# Altium schematic sheet Display Driver.SchDoc
size B
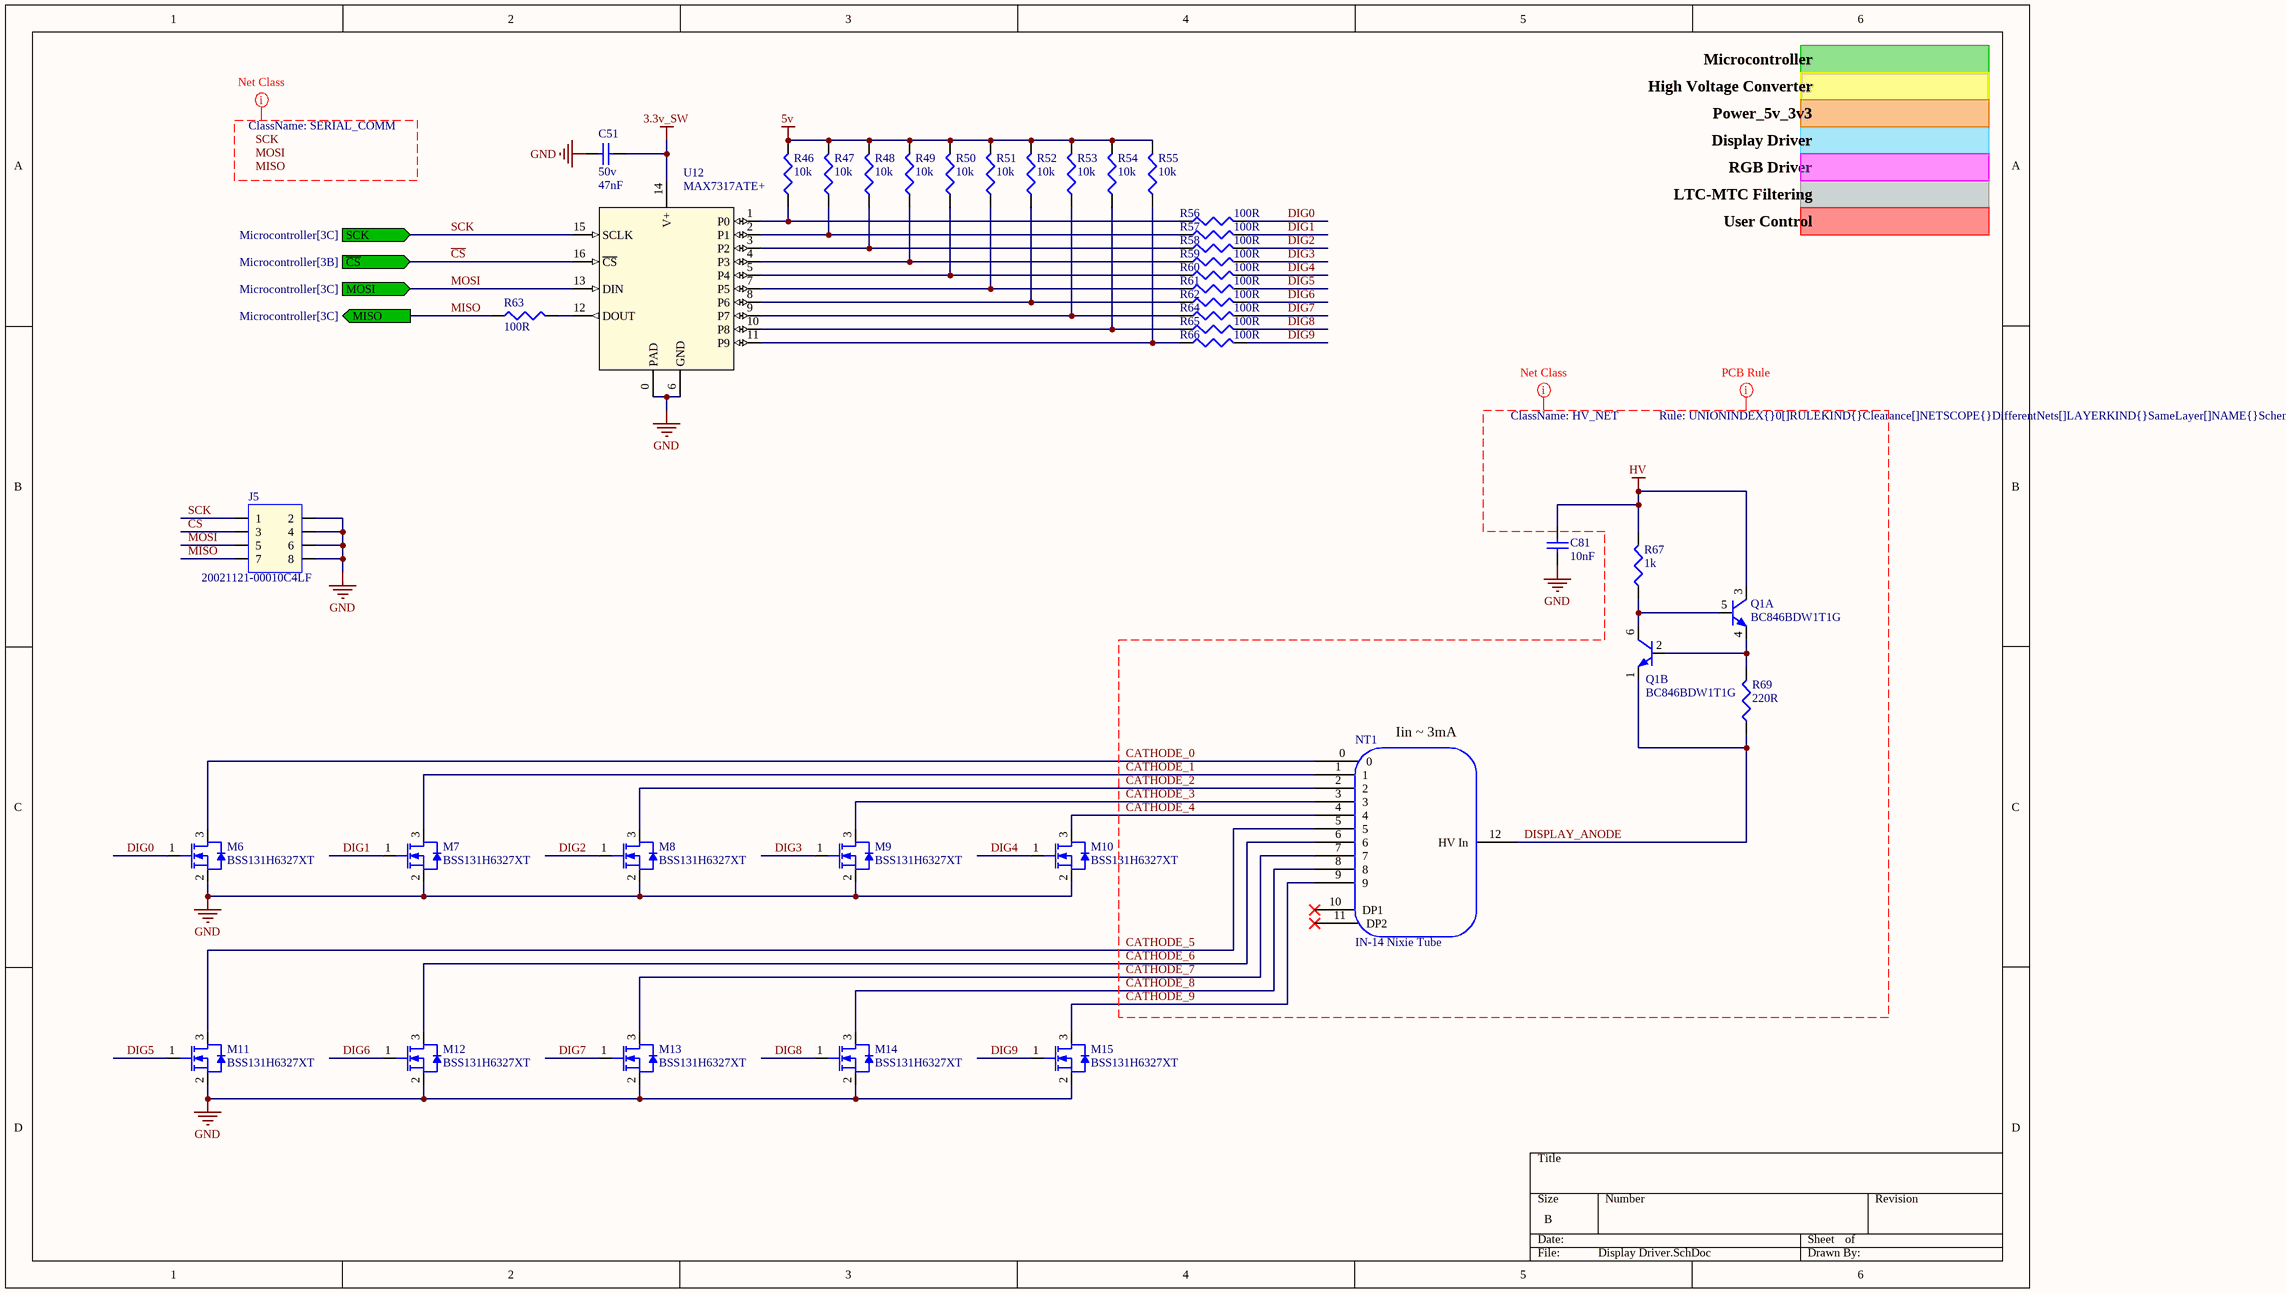
[diagram p0: Display Driver.SchDoc]

## Parts
C51  Voltage: 50v  [CAP0603R]  (hidden comment: 47nF)
C81  10nF  [CAP0805R]
J5  20021121-00010C4LF  [2x4 SMD Header 1.27mm]
M6  BSS131H6327XT  [SOT23-3 REFLOW]
M7  BSS131H6327XT  [SOT23-3 REFLOW]
M8  BSS131H6327XT  [SOT23-3 REFLOW]
M9  BSS131H6327XT  [SOT23-3 REFLOW]
M10  BSS131H6327XT  [SOT23-3 REFLOW]
M11  BSS131H6327XT  [SOT23-3 REFLOW]
M12  BSS131H6327XT  [SOT23-3 REFLOW]
M13  BSS131H6327XT  [SOT23-3 REFLOW]
M14  BSS131H6327XT  [SOT23-3 REFLOW]
M15  BSS131H6327XT  [SOT23-3 REFLOW]
NT1  IN-14 Nixie Tube  [IN-14 Nixie Tube]
Q1  BC846BDW1T1G  [SC70]  (parts A,B of 2)
R46  10k  [RES0402R]
R47  10k  [RES0402R]
R48  10k  [RES0402R]
R49  10k  [RES0402R]
R50  10k  [RES0402R]
R51  10k  [RES0402R]
R52  10k  [RES0402R]
R53  10k  [RES0402R]
R54  10k  [RES0402R]
R55  10k  [RES0402R]
R56  100R  [RES0402R]
R57  100R  [RES0402R]
R58  100R  [RES0402R]
R59  100R  [RES0402R]
R60  100R  [RES0402R]
R61  100R  [RES0402R]
R62  100R  [RES0402R]
R63  100R  [RES0402R]
R64  100R  [RES0402R]
R65  100R  [RES0402R]
R66  100R  [RES0402R]
R67  1k  [RES0402R]
R69  220R  [RES0603R]
U12  MAX7317ATE+  [TQFN-16]

## Ports
MISO (out, see Microcontroller[3C]), MOSI (in, see Microcontroller[3C]), SCK (in, see Microcontroller[3C]), ~{CS} (in, see Microcontroller[3B])

## Nets
3.3v_SW: C51.2 U12.14(V+)
5v: R46.2 R47.2 R48.2 R49.2 R50.2 R51.2 R52.2 R53.2 R54.2 R55.2
GND: C51.1 C81.2 J5.2 J5.4 J5.6 J5.8 M6.2(SOURCE) M7.2(SOURCE) M8.2(SOURCE) M9.2(SOURCE) M10.2(SOURCE) M11.2(SOURCE) M12.2(SOURCE) M13.2(SOURCE) M14.2(SOURCE) M15.2(SOURCE) U12.0(PAD) U12.6(GND)
HV: C81.1 Q1.3(E1) R67.2
~{CS}: J5.3 U12.16(~{CS}) ; port ~{CS}
CATHODE_0: M6.3(DRAIN) NT1.0
CATHODE_1: M7.3(DRAIN) NT1.1
CATHODE_2: M8.3(DRAIN) NT1.2
CATHODE_3: M9.3(DRAIN) NT1.3
CATHODE_4: M10.3(DRAIN) NT1.4
CATHODE_5: M11.3(DRAIN) NT1.5
CATHODE_6: M12.3(DRAIN) NT1.6
CATHODE_7: M13.3(DRAIN) NT1.7
CATHODE_8: M14.3(DRAIN) NT1.8
CATHODE_9: M15.3(DRAIN) NT1.9
DIG0: M6.1(GATE) R56.2
DIG1: M7.1(GATE) R57.2
DIG2: M8.1(GATE) R58.2
DIG3: M9.1(GATE) R59.2
DIG4: M10.1(GATE) R60.2
DIG5: M11.1(GATE) R61.2
DIG6: M12.1(GATE) R62.2
DIG7: M13.1(GATE) R64.2
DIG8: M14.1(GATE) R65.2
DIG9: M15.1(GATE) R66.2
DISPLAY_ANODE: NT1.12(HV_In) Q1.1(C2) R69.1
MISO: J5.7 R63.1 ; port MISO
MOSI: J5.5 U12.13(DIN) ; port MOSI
SCK: J5.1 U12.15(SCLK) ; port SCK
NetQ1_2: Q1.2(B2) Q1.4(C1) R69.2
NetQ1_5: Q1.5(B1) Q1.6(E2) R67.1
NetR46_1: R46.1 R56.1 U12.1(P0)
NetR47_1: R47.1 R57.1 U12.2(P1)
NetR48_1: R48.1 R58.1 U12.3(P2)
NetR49_1: R49.1 R59.1 U12.4(P3)
NetR50_1: R50.1 R60.1 U12.5(P4)
NetR51_1: R51.1 R61.1 U12.7(P5)
NetR52_1: R52.1 R62.1 U12.8(P6)
NetR53_1: R53.1 R64.1 U12.9(P7)
NetR54_1: R54.1 R65.1 U12.10(P8)
NetR55_1: R55.1 R66.1 U12.11(P9)
NetR63_2: R63.2 U12.12(DOUT)

Not connected (* = marked no-connect by the designer): NT1 10(DP1)* 11(DP2)*

## Layout directives
net class HV_NET: CATHODE_0, CATHODE_1, CATHODE_2, CATHODE_3, CATHODE_4, CATHODE_5, CATHODE_6, CATHODE_7, CATHODE_8, CATHODE_9, DISPLAY_ANODE, HV
rule Clearance Constraint [Clearance = 10mil]: CATHODE_0, CATHODE_1, CATHODE_2, CATHODE_3, CATHODE_4, CATHODE_5, CATHODE_6, CATHODE_7, CATHODE_8, CATHODE_9, DISPLAY_ANODE, HV
net class SERIAL_COMM: MISO, MOSI, SCK

## Notes on the sheet
- Microcontroller
- High Voltage Converter
- Display Driver
- Power_5v_3v3
- RGB Driver
- LTC-MTC Filtering
- User Control
- (near NT1) Iin ~ 3mA
- Labels drawn without touching a wire or pin: MISO, MOSI, SCK

## Library data of the parts
C51 = 47nF 50v (0603): Tolerance: 10%; MFG_PN: VJ0603Y473KXACW1BC; MFG: VISHAY; Value: 47nF
C81 = 10nF 250v (0805): Tolerance: 10%; MFG_PN: GRM21BR72E103KW03L; MFG: Murata; Voltage: 250v; LOAD: NL; Value: 10nF
J5 = 2x4 Header SMD (1.27mm): LOAD: NL; MFG: FCI; CURRENT: 1A; MFG_PN: 20021121-00010C4LF
M6-M15 = BSS131H6327XT: NFET_SINGLE_100mA_240v; MFG: INFINEON; VDS: 240v; VGS: 20v; RDS: 14R; CURRENT: 0.1A; MFG_PN: BSS131H6327XT
Q1 = BC846BDW1T1G: BJT, Dual NPN, 65v, 100mA; MFG: ON Semiconductor; VCBO: 80v; MFG_PN: BC846BDW1T1G; CURRENT: 100mA; VCEO: 65V
R46-R55 = 10k (0402): Tolerance: 1%; POWER: 63mW; MFG_PN: CRCW040210K0FKED; MFG: Vishay; Load: NL; Value: 10k
R56-R66 = 100R (0402): Tolerance: 1%; POWER: 63mW; MFG_PN: CRCW0402100RFKED; MFG: Vishay; Load: NL; Value: 100R
R67 = 1k (0402): Tolerance: 1%; POWER: 63mW; MFG_PN: CRCW04021K00FKED; MFG: Vishay; Load: NL; Value: 1k
R69 = 220R (0603): Tolerance: 1%; POWER: 0.1W; MFG_PN: CRCW0603220RFKEB; MFG: Vishay; Load: NL; Value: 220R
U12 = MAX7317ATE+: Port Expander, 10-bit, SPI; MFG: MAXIM; CHANNELS: 10; V_SUPPLY: 3.6v; VOUT_MAX: 7v; IOUT: 24mA; MFG_PN: MAX7317ATE+; COMMUNICATION: SPI